# Altium schematic sheet HPFREF1-2pole.SCHDOC
size B
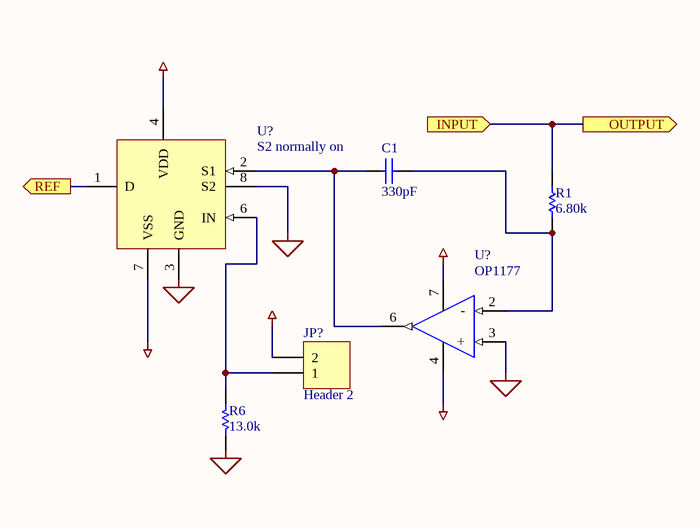
[diagram p0: HPFREF1-2pole.SCHDOC]

## Parts
(Parts that share a designator on the sheet are numbered #1, #2 ... from top to bottom, then left to right.)
C1  value 330pF  [CC3216-1206]  (hidden comment: Cap)
JP?  Header 2  [HDR1X2]
R1  value 6.80k  [CC2012-0805]  (hidden comment: Res1)
R6  value 13.0k  [CC2012-0805]  (hidden comment: Res1)
U?#1  S2 normally on  [MSOP8]
U?#2  OP1177  [SO-G8/X.6]

## Ports
INPUT (in), OUTPUT (out), REF (out)

## Nets
AVDD: JP?.2 U?#1.4(VDD) U?#2.7(+Vs)
AVSS: U?#1.7(VSS) U?#2.4(-Vs)
GND: R6.1 U?#1.3(GND) U?#1.8(S2) U?#2.3(+)
INPUT: R1.1 ; port INPUT, port OUTPUT
REF: U?#1.1(D) ; port REF
NetC1_1: C1.1 R1.2 U?#2.2(-)
NetC1_2: C1.2 U?#1.2(S1) U?#2.6(Out)
NetJP?_1: JP?.1 R6.2 U?#1.6(IN)

## Library data of the parts
C1 = Cap: Capacitor; Manufacturer: Generic Components; Class I: Passive; Published: 8-Jun-2000; Revision: July-2002: Re-released for DXP Platform.; Publisher: Altium Limited; Class II: Capacitor
JP? = Header 2: Header, 2-Pin; Manufacturer: Generic Components; Class I: Connector; Revision: July-2002: Re-released for DXP Platform.; Publisher: Altium Limited
R1 R6 = Res1: Resistor; Manufacturer: Generic Components; Class I: Passive; Published: 8-Jun-2000; Revision: July-2002: Re-released for DXP Platform.; Publisher: Altium Limited; Class II: Resistor
U?#1 = ADG619: Low RON SPDT Switch
U?#2 = OP1177: AD Precision Low Noise, Low Input Bias Current Operational Amplifier